# Altium project SSL-Motherboard.PrjPcb
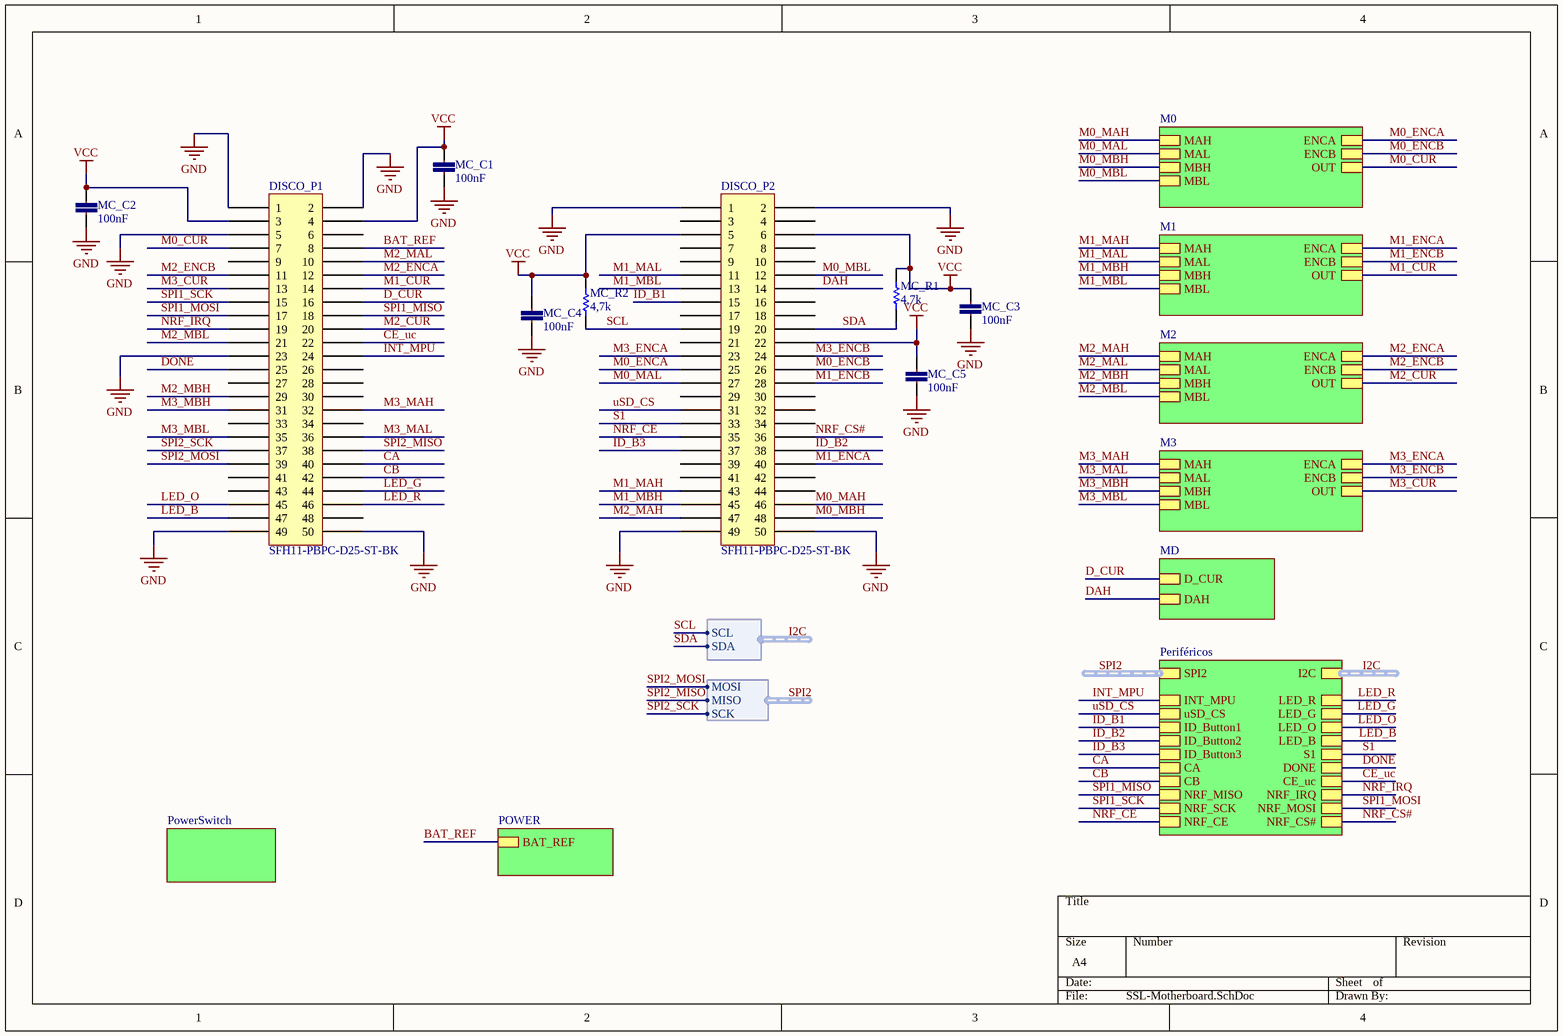
[diagram p0: SSL-Motherboard.SchDoc]
6 sheets, 114 parts. Net scope: hierarchical (ports join the sheet entries above them; power ports are global).
Board file: SSL-Motherboard.PcbDoc
Sheets:
  SSL-Motherboard.SchDoc
    M0 = Motors.SchDoc
    POWER = PowerSupply.SchDoc
    M1 = Motors.SchDoc
    M2 = Motors.SchDoc
    M3 = Motors.SchDoc
    Periféricos = Peripherals.SchDoc
    MD = Dribble.SchDoc
    PowerSwitch = PowerSwitch.SchDoc

## Sheet SSL-Motherboard.SchDoc
size A4

### Parts
DISCO_P1  SFH11-PBPC-D25-ST-BK  [25x02_Conector_Female]
DISCO_P2  SFH11-PBPC-D25-ST-BK  [25x02_Conector_Female]
MC_C1  100nF  [0402-CAP]
MC_C2  100nF  [0402-CAP]
MC_C3  100nF  [0402-CAP]
MC_C4  100nF  [0402-CAP]
MC_C5  100nF  [0402-CAP]
MC_R1  4,7k  [0402]
MC_R2  4,7k  [0402]

### Sub-sheets
M0 = Motors.SchDoc: MBH, MAH, MBL, MAL, ENCA, ENCB, OUT
M1 = Motors.SchDoc: MBH, MAH, MBL, MAL, ENCA, ENCB, OUT
M2 = Motors.SchDoc: MBH, MAH, MBL, MAL, ENCA, ENCB, OUT
M3 = Motors.SchDoc: MBH, MAH, MBL, MAL, ENCA, ENCB, OUT
MD = Dribble.SchDoc: D_CUR, DAH
Periféricos = Peripherals.SchDoc: INT_MPU, uSD_CS, LED_R, LED_G, LED_O, LED_B, ID_Button1, SPI2 (harness SPI), I2C (harness I2C), S1, CA, CB, CE_uc, NRF_MISO, NRF_SCK, NRF_CE, NRF_IRQ, NRF_MOSI, NRF_CS#, ID_Button2, ID_Button3, DONE
POWER = PowerSupply.SchDoc: BAT_REF
PowerSwitch = PowerSwitch.SchDoc: no entries

### Harnesses
I2C: SCL, SDA
SPI: MOSI, MISO, SCK

### Nets
GND: DISCO_P1.1 DISCO_P1.2 DISCO_P1.5 DISCO_P1.23 DISCO_P1.49 DISCO_P1.50 DISCO_P2.1 DISCO_P2.2 DISCO_P2.49 DISCO_P2.50 MC_C1.1 MC_C2.2 MC_C3.1 MC_C4.1 MC_C5.1
VCC: DISCO_P1.3 DISCO_P1.4 DISCO_P2.5 DISCO_P2.6 DISCO_P2.22 MC_C1.2 MC_C2.1 MC_C3.2 MC_C4.2 MC_C5.2 MC_R1.2 MC_R2.2
BAT_REF: DISCO_P1.8 ; sheet POWER/BAT_REF
CA: DISCO_P1.40 ; sheet Periféricos/CA
CB: DISCO_P1.42 ; sheet Periféricos/CB
CE_uc: DISCO_P1.22 ; sheet Periféricos/CE_uc
D_CUR: DISCO_P1.16 ; sheet MD/D_CUR
DAH: DISCO_P2.14 ; sheet MD/DAH
DONE: DISCO_P1.25 ; sheet Periféricos/DONE
ID_B1: DISCO_P2.15 ; sheet Periféricos/ID_Button1
ID_B2: DISCO_P2.38 ; sheet Periféricos/ID_Button2
ID_B3: DISCO_P2.37 ; sheet Periféricos/ID_Button3
INT_MPU: DISCO_P1.24 ; sheet Periféricos/INT_MPU
LED_B: DISCO_P1.47 ; sheet Periféricos/LED_B  [project net Blue_led]
LED_G: DISCO_P1.44 ; sheet Periféricos/LED_G
LED_O: DISCO_P1.45 ; sheet Periféricos/LED_O
LED_R: DISCO_P1.46 ; sheet Periféricos/LED_R
M0_CUR: DISCO_P1.7 ; sheet M0/OUT
M0_ENCA: DISCO_P2.25 ; sheet M0/ENCA
M0_ENCB: DISCO_P2.26 ; sheet M0/ENCB
M0_MAH: DISCO_P2.46 ; sheet M0/MAH
M0_MAL: DISCO_P2.27 ; sheet M0/MAL
M0_MBH: DISCO_P2.48 ; sheet M0/MBH
M0_MBL: DISCO_P2.12 ; sheet M0/MBL
M1_CUR: DISCO_P1.14 ; sheet M1/OUT
M1_ENCA: DISCO_P2.40 ; sheet M1/ENCA
M1_ENCB: DISCO_P2.28 ; sheet M1/ENCB
M1_MAH: DISCO_P2.43 ; sheet M1/MAH
M1_MAL: DISCO_P2.11 ; sheet M1/MAL
M1_MBH: DISCO_P2.45 ; sheet M1/MBH
M1_MBL: DISCO_P2.13 ; sheet M1/MBL
M2_CUR: DISCO_P1.20 ; sheet M2/OUT
M2_ENCA: DISCO_P1.12 ; sheet M2/ENCA
M2_ENCB: DISCO_P1.11 ; sheet M2/ENCB
M2_MAH: DISCO_P2.47 ; sheet M2/MAH
M2_MAL: DISCO_P1.10 ; sheet M2/MAL
M2_MBH: DISCO_P1.29 ; sheet M2/MBH
M2_MBL: DISCO_P1.21 ; sheet M2/MBL
M3_CUR: DISCO_P1.13 ; sheet M3/OUT
M3_ENCA: DISCO_P2.23 ; sheet M3/ENCA
M3_ENCB: DISCO_P2.24 ; sheet M3/ENCB
M3_MAH: DISCO_P1.32 ; sheet M3/MAH
M3_MAL: DISCO_P1.36 ; sheet M3/MAL
M3_MBH: DISCO_P1.31 ; sheet M3/MBH
M3_MBL: DISCO_P1.35 ; sheet M3/MBL
NRF_CE: DISCO_P2.35 ; sheet Periféricos/NRF_CE
NRF_CS#: DISCO_P2.36 ; sheet Periféricos/NRF_CS#
NRF_IRQ: DISCO_P1.19 ; sheet Periféricos/NRF_IRQ
S1: DISCO_P2.33 ; sheet Periféricos/S1
SCL: DISCO_P2.19 MC_R2.1 ; sheet Periféricos/I2C.SCL  [project net I2C.SCL]
SDA: DISCO_P2.20 MC_R1.1 ; sheet Periféricos/I2C.SDA  [project net I2C.SDA]
SPI1_MISO: DISCO_P1.18 ; sheet Periféricos/NRF_MISO
SPI1_MOSI: DISCO_P1.17 ; sheet Periféricos/NRF_MOSI
SPI1_SCK: DISCO_P1.15 ; sheet Periféricos/NRF_SCK
SPI2_MISO: DISCO_P1.38 ; sheet Periféricos/SPI2.MISO  [project net SPI2.MISO]
SPI2_MOSI: DISCO_P1.39 ; sheet Periféricos/SPI2.MOSI  [project net SPI2.MOSI]
SPI2_SCK: DISCO_P1.37 ; sheet Periféricos/SPI2.SCK  [project net SPI2.SCK]
uSD_CS: DISCO_P2.31 ; sheet Periféricos/uSD_CS

Not connected (* = marked no-connect by the designer): DISCO_P1 6 9 26 27 28 30 33 34 41 43 48; DISCO_P2 3 4 7 8 9 10 16 17 18 21 29 30 32 34 39 41 42 44

### Buses and harness runs
harness I2C = sheet Periféricos/I2C
harness SPI2 = sheet Periféricos/SPI2

### Library data of the parts
DISCO_P1 DISCO_P2 = 25x02_Conector_Female: 50 Position Header Connector 0.100" (2.54mm) Through Hole Gold
MC_C1-MC_C5 = CC0402-100nF-A.12: CAP CER 0.1UF 10V 20% X5R 0402; Part No: VJ0402V104ZXQPBC; Cod EMS: 05.281.006.133; Value: 100n
MC_R1 MC_R2 = Res1: Resistor; Published: 8-Jun-2000; LatestRevisionDate: 17-Jul-2002; LatestRevisionNote: Re-released for DXP Platform.; PackageReference: AXIAL-0.3; Publisher: Altium Limited; PackageDescription: Axial Device, Thru-Hole; 2 Leads; 0.3 in Pin Spacing; Value: 4,7K

## Sheet Motors.SchDoc
size A4
Used 4 times, as channels M0, M1, M2, M3. Parts and nets are listed once, with the designators drawn on the sheet.
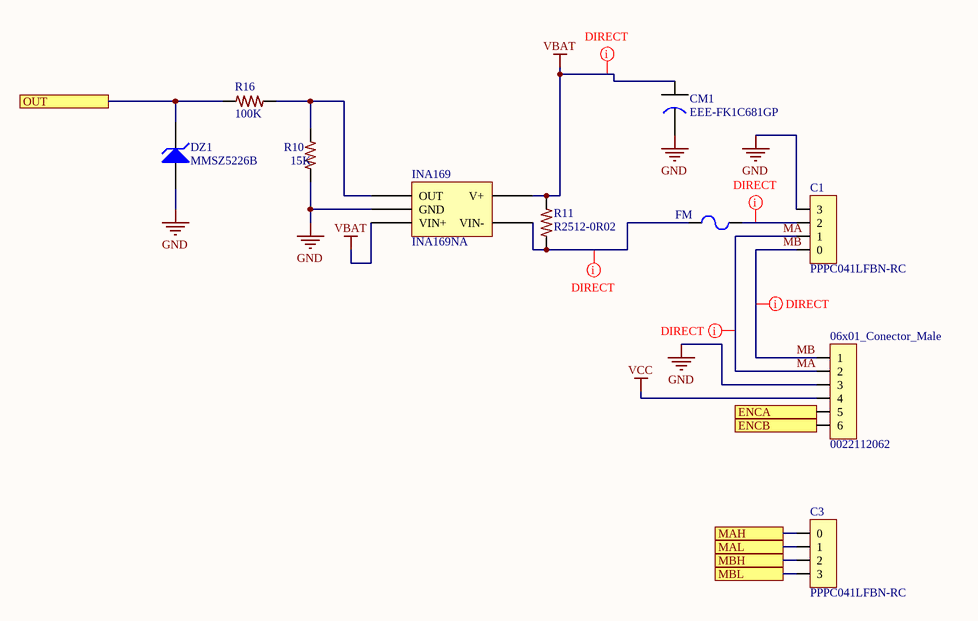
[diagram p1: Motors.SchDoc]

### Parts
06x01_Conector_Male  0022112062  [06x01_Conector_Male]
C1  PPPC041LFBN-RC  [04x01_Conector_Female]
C3  PPPC041LFBN-RC  [04x01_Conector_Female]
CM1  EEE-FK1C681GP  [EEE-FK1C681GP]
DZ1  MMSZ5226B  [FAIR-SOD-123-2_V]
FM  MF-MSMF250/16X  [RESC4632X16N]  (value not drawn)
INA169  INA169NA  [SOT95P280X125-5N]
R10  15K  [0402-RES-HD]
R11  R2512-0R02  [2512-RES-HD]
R16  100K  [0402-RES-HD]

### Ports
ENCA, ENCB, MAH, MAL, MBH, MBL, OUT

### Nets
GND: 06x01_Conector_Male.3 C1.3 CM1.2 DZ1.1(A) INA169.2(GND) R10.1
VBAT: CM1.1 INA169.3(VIN+) INA169.4(V+) R11.2
VCC: 06x01_Conector_Male.4
ENCA: 06x01_Conector_Male.5 ; port ENCA
ENCB: 06x01_Conector_Male.6 ; port ENCB
MA: 06x01_Conector_Male.2 C1.1
MAH: C3.0 ; port MAH
MAL: C3.1 ; port MAL
MB: 06x01_Conector_Male.1 C1.0
MBH: C3.2 ; port MBH
MBL: C3.3 ; port MBL
OUT: DZ1.2(K) R16.2 ; port OUT
NetC1_2: C1.2 FM.1
NetFM_2: FM.2 INA169.5(VIN-) R11.1
NetINA169_1: INA169.1(OUT) R10.2 R16.1

### Channels
M0: designators end in _M0; ports ENCA=M0_ENCA ENCB=M0_ENCB MAH=M0_MAH MAL=M0_MAL MBH=M0_MBH MBL=M0_MBL OUT=M0_CUR
M1: designators end in _M1; ports ENCA=M1_ENCA ENCB=M1_ENCB MAH=M1_MAH MAL=M1_MAL MBH=M1_MBH MBL=M1_MBL OUT=M1_CUR
M2: designators end in _M2; ports ENCA=M2_ENCA ENCB=M2_ENCB MAH=M2_MAH MAL=M2_MAL MBH=M2_MBH MBL=M2_MBL OUT=M2_CUR
M3: designators end in _M3; ports ENCA=M3_ENCA ENCB=M3_ENCB MAH=M3_MAH MAL=M3_MAL MBH=M3_MBH MBL=M3_MBL OUT=M3_CUR

### Layout directives
net class DIRECT: MA_M0, MB_M0, NetC1_M0_2, NetFM_M0_2, VBAT

### Library data of the parts
06x01_Conector_Male = 06x01_Conector_Male: CONN HEADER 6POS .100 VERT GOLD
C1 C3 = 04x01_Conector_Female-SCH: 4 Position Header Connector 0.100" (2.54mm) Through Hole Gold
CM1 = CAP AL 680UF/16V: Aluminum Electrolytic Capacitors - SMD Al Lytic Cap SMT FK Series 105C
DZ1 = CMP-2000-06741-1: Zener Diode, 3.3 V, -55 to 150 degC, 2-Pin SOD-123，RoHS, Tape and Reel; Manufacturer: FairchildSemiconductor; Configuration: Single; Maximum Reverse Leakage Current: 25uA; Zener Voltage Tolerance: 5%; Rad Hard: No; Maximum Power Dissipation: 500mW; Nominal Zener Voltage: 3.3V; Mounting: SurfaceMount; Datasheet Version: Rev. 1.6, 10/2015; Operating Temperature: -55to150°C; Category: Zener; Package: 2SOD-123; Package Reference: SOD-123-2; Datasheet URL: https://www.fairchildsemi.com/datasheets/MM/MMSZ5226B.pdf; Packaging: Tape&Reel; Mounting Technology: SurfaceMount; Package Description: 2-Pin Surface Mount Device, Body 2.7 x 1.6 mm; Manufacturer URL: https://www.fairchildsemi.com/
FM = MF-MSMF250/16X-01.A.1: PTC RESETTABLE .30A 30V 1812
INA169 = INA169NA-01.A.1: IC CURRENT MONITOR 0.5% SOT23-5
R10 R16 = R0402-1K-A.9: RES 1K OHM 1/10W 1% 0402 SMD; Part No: ERJ-2RKF1001X; Cod EMS: 05.280.029.527; Family Description: RESISTOR FILME ESPESSO 10R-1M / 1/10W / 1% / 0402. P/N: ERJ-2RKF....X – PANASONIC ELECTRONIC COMPONENTS.; Value: 1K; Family: ERJ-2RKF....X
R11 = R2512-0R02-4: RES .02 OHM 2W 1% 2512 SMD; Part No: WSL2512R0200FEA18; Cod EMS: 05.280.029.529; Value: 0.02; Family Description: RESISTOR SENTIDO DE CORRENTE 0,010R-0,040R/ 2W / 1% / 2512 P/N: WSL2512.....FEA18 – VISHAY DALE.; Family: WSL2512.....FEA18

## Sheet PowerSupply.SchDoc
size A4
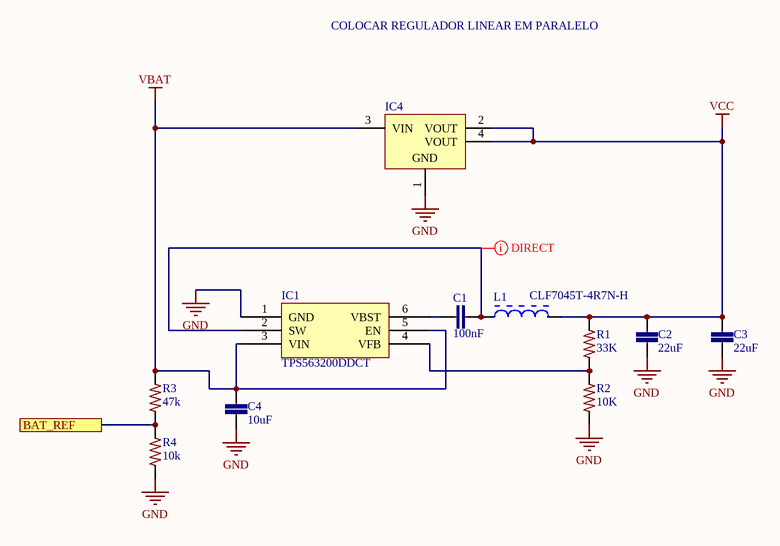
[diagram p2: PowerSupply.SchDoc]

### Parts
C1  100nF  [0402-CAP]
C2  22uF  [1206-CAP]
C3  22uF  [1206-CAP]
C4  10uF  [1210-CAP]
IC1  TPS563200DDCT  [SOT95P280X110-6N]
IC4  LD1117S33CTR  [SOT-223_N]  (value not drawn)
L1  CLF7045T-4R7N-H  [CLF7045T]
R1  33K  [0402-RES-HD]
R2  10K  [0402-RES-HD]
R3  47k  [0402-RES-HD]
R4  10k  [0402-RES-HD]

### Ports
BAT_REF

### Nets
GND: C2.1 C3.1 C4.1 IC1.1(GND) IC4.1(GND) R2.1 R4.1
VBAT: C4.2 IC1.3(VIN) IC1.5(EN) IC4.3(VIN) R3.2
VCC: C2.2 C3.2 IC4.2(VOUT) IC4.4(VOUT) L1.2 R1.2
BAT_REF: R3.1 R4.2 ; port BAT_REF
NetC1_1: C1.1 IC1.6(VBST)
NetC1_2: C1.2 IC1.2(SW) L1.1
NetIC1_4: IC1.4(VFB) R1.1 R2.2

### Layout directives
net class DIRECT: NetC1_2

### Notes on the sheet
- COLOCAR REGULADOR LINEAR EM PARALELO

### Library data of the parts
C1 = CC0402-100nF-50v-A.3: CAP CER 0.1UF 50V 10% X7R 0402; Part No: C1005X7R1H104K050BB; Value: 100n; Cod EMS: 05.281.019.021
C2 C3 = CC1206-22uF-6.3V-1: CAP CER 22UF 6.3V 20% X5R 1206; Part No: C3216X5R0J226M085AC; Value: 22u; Rule: UNIONINDEX{}0[]RULEKIND{}PolygonConnect[]NETSCOPE{}AnyNet[]LAYERKIND{}SameLayer[]NAME{}Schematic Polygon Connect Style[]CONNECTSTYLE{}Direct[]RELIEFCONDUCTORWIDTH{}10mil[]RELIEFENTRIES{}4[]POLYGONRELIEFANGLE{}45 Angle[]AIRGAPWIDTH{}10mil[]UNIT{}Imperial[]PcbType{}ProtelPcb
C4 = CC1210-10uF-6: CAP CER 10UF 50V 20% X5R 1210; Part No: UMK325BJ106MM; value: 10u; Cod EMS: 05.281.019.522
IC1 = TPS563200DDCT-01.A.2: IC REG BUCK ADJ 3A SYNC 6SOT
IC4 = CMP-0244-00307-1: Fixed Low Drop Positive Voltage Regulator, 3.3V, 4-Pin SOT-223, Tape and Reel; ComponentLink1URL: http://www.st.com; PackageVersion: 2010; ComponentLink1Description: Manufacturer URL; DatasheetVersion: 1/11/2011; ComponentLink2URL: http://www.st.com/internet/com/TECHNICAL_RESOURCES/TECHNICAL_LITERATURE/DATASHEET/CD00000544.pdf; PackageReference: SOT-223; ComponentLink2Description: Datasheet; PackageDescription: 4-Pin SOT-223 Package, 6.5 x 3.5 mm Body, 2.3 mm Pitch, 7 mm Lead Span
L1 = CLF7045T-4R7N-H-2: FIXED IND 4.7UH 4.1A 20 MOHM SMD; Family Description: INDUTORES FIXOS 7,2x6,9mm TDK CLF7045T -45 A 125oC; Rule: UNIONINDEX{}0[]RULEKIND{}PolygonConnect[]NETSCOPE{}AnyNet[]LAYERKIND{}SameLayer[]NAME{}Schematic Polygon Connect Style[]CONNECTSTYLE{}Direct[]RELIEFCONDUCTORWIDTH{}10mil[]RELIEFENTRIES{}4[]POLYGONRELIEFANGLE{}45 Angle[]AIRGAPWIDTH{}10mil[]UNIT{}Imperial[]PcbType{}ProtelPcb; Part No: CLF7045T-4R7N-H; Family: CLF7045T
R1 = R0402-33K-7: RES 33K OHM 1/10W 1% 0402 SMD; Part No: ERJ-2RKF3302X; Family Description: RESISTOR FILME ESPESSO 10R-1M / 1/10W / 1% / 0402. P/N: ERJ-2RKF....X – PANASONIC ELECTRONIC COMPONENTS.; Cod EMS: 05.280.029.535; Value: 33K; Family: ERJ-2RKF....X
R2 = R0402-10K-10: RES 10K OHM 1/10W 1% 0402 SMD; Part No: ERJ-2RKF1002X; Cod EMS: 05.280.029.525; Family Description: RESISTOR FILME ESPESSO 10R-1M / 1/10W / 1% / 0402. P/N: ERJ-2RKF....X – PANASONIC ELECTRONIC COMPONENTS.; Value: 10K; Family: ERJ-2RKF....X
R3 = R0402-10K-10: RES 47k OHM 1/10W 1% 0402 SMD; Part No: ERJ-2RKF1002X; Cod EMS: 05.280.029.525; Value: 330; Family Description: RESISTOR FILME ESPESSO 10R-1M / 1/10W / 1% / 0402. P/N: ERJ-2RKF....X – PANASONIC ELECTRONIC COMPONENTS.; Family: ERJ-2RKF....X
R4 = R0402-33K-7: RES 10k OHM 1/10W 1% 0402 SMD; Part No: ERJ-2RKF3302X; Cod EMS: 05.280.029.535; Value: 100; Family Description: RESISTOR FILME ESPESSO 10R-1M / 1/10W / 1% / 0402. P/N: ERJ-2RKF....X – PANASONIC ELECTRONIC COMPONENTS.; Family: ERJ-2RKF....X

## Sheet Peripherals.SchDoc
size A4
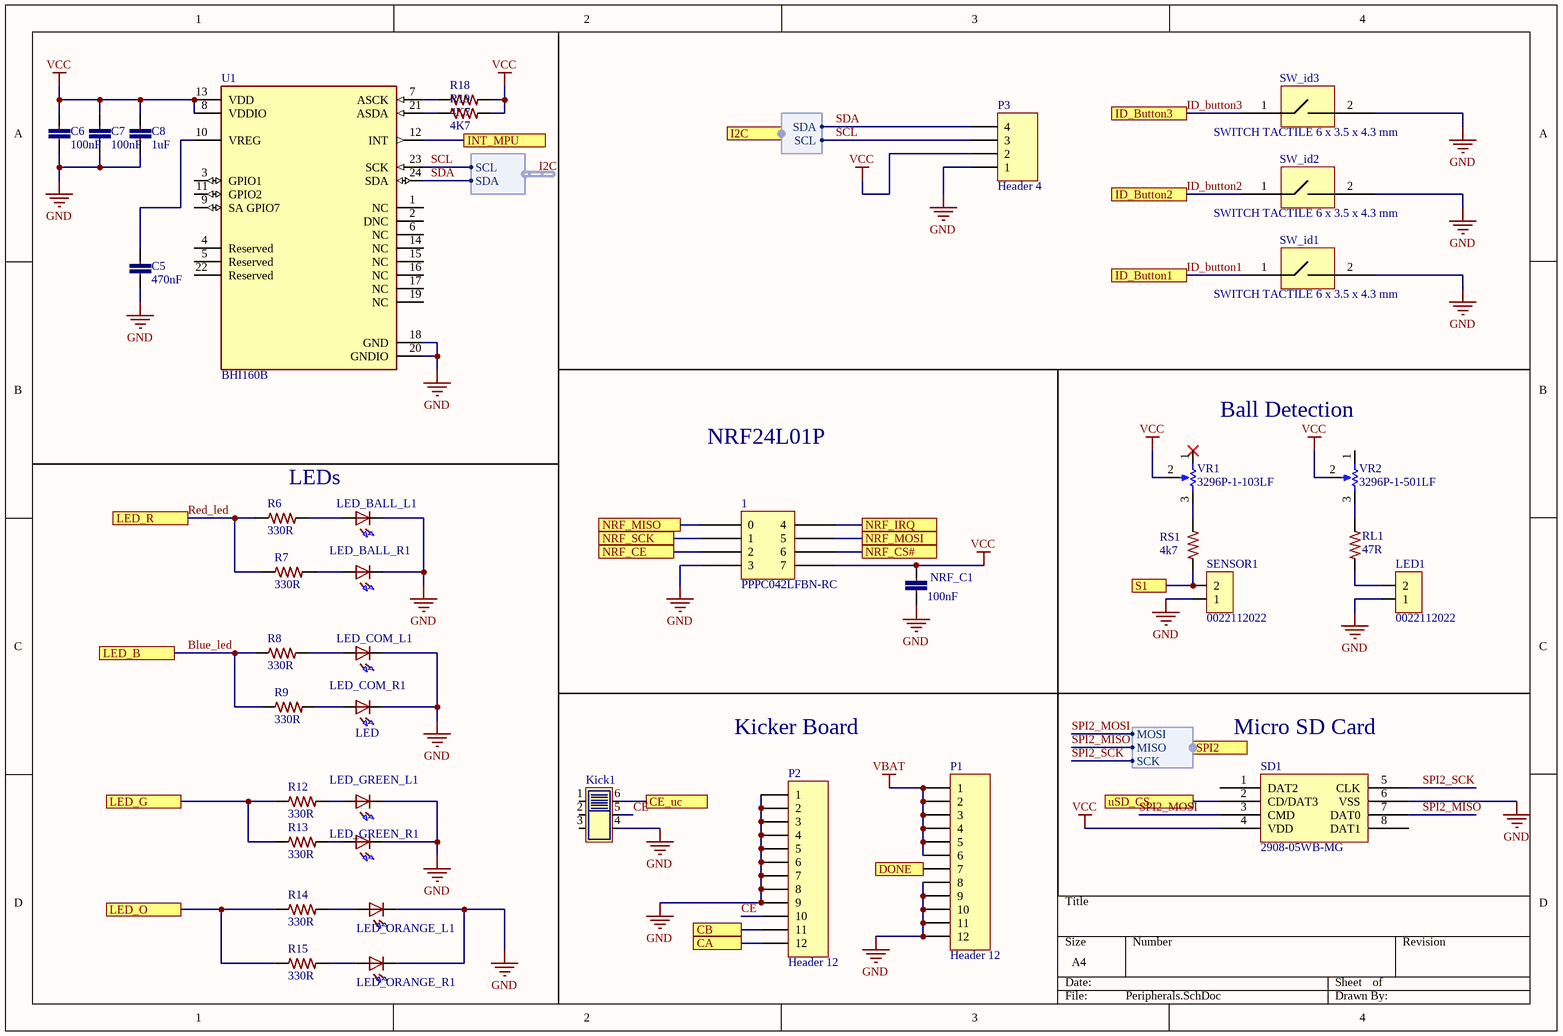
[diagram p3: Peripherals.SchDoc]

### Parts
1  PPPC042LFBN-RC  [04x02_Conector_Female]
C5  470nF  [0402-CAP]
C6  100nF  [0402-CAP]
C7  100nF  [0402-CAP]
C8  1uF  [0402-CAP]
Kick1  JS202011SCQN  [SOP250P750X350-6N]  (value not drawn)
LED1  0022112022  [02x01_Conector_Male]
LED_BALL_L1  LED  [LED-5MM-PCB]  (value not drawn)
LED_BALL_R1  LED  [LED-5MM-PCB]  (value not drawn)
LED_COM_L1  LED  [LED-5MM-PCB]  (value not drawn)
LED_COM_R1  LED  [LED-5MM-PCB]
LED_GREEN_L1  LED  [LED-5MM-PCB]  (value not drawn)
LED_GREEN_R1  LED  [LED-5MM-PCB]  (value not drawn)
LED_ORANGE_L1  LED  [LED-5MM-PCB]  (value not drawn)
LED_ORANGE_R1  LED  [LED-5MM-PCB]  (value not drawn)
NRF_C1  100nF  [0402-CAP]
P1  Header 12  [HDR1X12]
P2  Header 12  [HDR1X12]
P3  Header 4  [HDR1X4]
R6  330R  [0402-RES-HD]
R7  330R  [0402-RES-HD]
R8  330R  [0402-RES-HD]
R9  330R  [0402-RES-HD]
R12  330R  [0402-RES-HD]
R13  330R  [0402-RES-HD]
R14  330R  [0402-RES-HD]
R15  330R  [0402-RES-HD]
R18  4K7  [0805-RES]
R19  4K7  [0805-RES]
RL1  47R  [0402-RES-HD]
RS1  4k7  [0402-RES-HD]
SD1  2908-05WB-MG  [New footprint 1]
SENSOR1  0022112022  [02x01_Conector_Male]
SW_id1  SWITCH TACTILE 6 x 3.5 x 4.3 mm  [PCBComponent]
SW_id2  SWITCH TACTILE 6 x 3.5 x 4.3 mm  [PCBComponent]
SW_id3  SWITCH TACTILE 6 x 3.5 x 4.3 mm  [PCBComponent]
U1  BHI160B  [FP-BHI160B-MFG]
VR1  3296P-1-103LF  [3296P]
VR2  3296P-1-501LF  [3296P]

### Ports
CA, CB, CE_uc, DONE, I2C (harness I2C), ID_Button1, ID_Button2, ID_Button3, INT_MPU, LED_B, LED_G, LED_O, LED_R, NRF_CE, NRF_CS#, NRF_IRQ, NRF_MISO, NRF_MOSI, NRF_SCK, S1, SPI2 (harness SPI), uSD_CS

### Harnesses
I2C: SCL, SDA
SPI: MOSI, MISO, SCK

### Nets
GND: 1.3 C5.2 C6.2 C7.2 C8.2 Kick1.4 LED1.1 LED_BALL_L1.1(K) LED_BALL_R1.1(K) LED_COM_L1.1(K) LED_COM_R1.1(K) LED_GREEN_L1.1(K) LED_GREEN_R1.1(K) LED_ORANGE_L1.1(K) LED_ORANGE_R1.1(K) NRF_C1.2 P1.8 P1.9 P1.10 P1.11 P1.12 P2.1 P2.2 P2.3 P2.4 P2.5 P2.6 P2.7 P2.8 P2.9 P3.1 SD1.6(VSS) SENSOR1.1 SW_id1.2 SW_id2.2 SW_id3.2 U1.18(GND) U1.20(GNDIO)
VBAT: P1.1 P1.2 P1.3 P1.4 P1.5 P1.6
VCC: 1.7 C6.1 C7.1 C8.1 NRF_C1.1 P3.2 R18.2 R19.2 SD1.4(VDD) U1.8(VDDIO) U1.13(VDD) VR1.2(Wiper) VR2.2(Wiper)
Blue_led: R8.1 R9.1 ; port LED_B
CA: P2.12 ; port CA
CB: P2.11 ; port CB
CE: Kick1.5 P2.10
CE_uc: Kick1.6 ; port CE_uc
DONE: P1.7 ; port DONE
ID_button1: SW_id1.1 ; port ID_Button1  [project net ID_B1]
ID_button2: SW_id2.1 ; port ID_Button2  [project net ID_B2]
ID_button3: SW_id3.1 ; port ID_Button3  [project net ID_B3]
INT_MPU: U1.12(INT) ; port INT_MPU
LED_G: R12.1 R13.1 ; port LED_G
LED_O: R14.1 R15.1 ; port LED_O
NRF_CE: 1.2 ; port NRF_CE
NRF_CS#: 1.6 ; port NRF_CS#
NRF_IRQ: 1.4 ; port NRF_IRQ
Red_led: R6.1 R7.1 ; port LED_R  [project net LED_R]
S1: RS1.1 SENSOR1.2 ; port S1
SCL: P3.3 U1.23(SCK) ; port I2C.SCL, harness I2C.SCL  [project net I2C.SCL]
SDA: P3.4 U1.24(SDA) ; port I2C.SDA, harness I2C.SDA  [project net I2C.SDA]
SPI1_MISO: 1.0 ; port NRF_MISO
SPI1_MOSI: 1.5 ; port NRF_MOSI
SPI1_SCK: 1.1 ; port NRF_SCK
SPI2_MISO: SD1.7(DAT0) ; port SPI2.MISO  [project net SPI2.MISO]
SPI2_MOSI: SD1.3(CMD) ; port SPI2.MOSI  [project net SPI2.MOSI]
SPI2_SCK: SD1.5(CLK) ; port SPI2.SCK  [project net SPI2.SCK]
uSD_CS: SD1.2(CD/DAT3) ; port uSD_CS
NetC5_1: C5.1 U1.10(VREG)
NetLED1_2: LED1.2 RL1.2
NetLED_BALL_L1_2: LED_BALL_L1.2(A) R6.2
NetLED_BALL_R1_2: LED_BALL_R1.2(A) R7.2
NetLED_COM_L1_2: LED_COM_L1.2(A) R8.2
NetLED_COM_R1_2: LED_COM_R1.2(A) R9.2
NetLED_GREEN_L1_2: LED_GREEN_L1.2(A) R12.2
NetLED_GREEN_R1_2: LED_GREEN_R1.2(A) R13.2
NetLED_ORANGE_L1_2: LED_ORANGE_L1.2(A) R14.2
NetLED_ORANGE_R1_2: LED_ORANGE_R1.2(A) R15.2
NetR18_1: R18.1 U1.7(ASCK)
NetR19_1: R19.1 U1.21(ASDA)
NetRL1_1: RL1.1 VR2.3(CW)
NetRS1_2: RS1.2 VR1.3(CW)

Not connected (* = marked no-connect by the designer): Kick1 1 2 3; SD1 1(DAT2) 8(DAT1); U1 1(NC) 2(DNC) 3(GPIO1) 4(Reserved) 5(Reserved) 6(NC) 9(SA_GPIO7) 11(GPIO2) 14(NC) 15(NC) 16(NC) 17(NC) 19(NC) 22(Reserved); VR1 1(CCW)*; VR2 1(CCW)

### Notes on the sheet
- NRF24L01P
- Ball Detection
- LEDs
- Kicker Board
- (near SD1) Micro SD Card

### Library data of the parts
1 = 04x02_Conector_Female: 8 Position Header Connector 0.100" (2.54mm) Through Hole Gold
C5 = CMP-00169-1: CAP CER 0402 470nF 25V X5R; Part No: C1005X5R1E474K050; Cod EMS: 05.281.019.543; Value: 470nF; Component Type: Capacitor
C6 C7 NRF_C1 = CC0402-100nF-A.12: as MC_C1 on sheet SSL-Motherboard
C8 = CC0402-1uF-5: CAP CER 1UF 6.3V 10% X5R 0402; Part No: JMK105BJ105KV-F; Cod EMS: 05.281.019.513; Value: 1u
Kick1 = JS202011SCQN-1: SWITCH SLIDE DPDT 300MA 6V; Part No: JS202011SCQN
LED1 SENSOR1 = 02x01_Conector_Male: CONN HEADER 2POS .100 VERT GOLD
LED_BALL_L1 LED_BALL_R1 LED_COM_L1 LED_COM_R1 LED_GREEN_L1 LED_GREEN_R1 LED_ORANGE_L1 LED_ORANGE_R1 = LED-5MM-3: LED 5MM PTH
P1 P2 = Header 12: Header, 12-Pin; LatestRevisionDate: 17-Jul-2002; LatestRevisionNote: Re-released for DXP Platform.; Publisher: Altium Limited
P3 = Header 4: Header, 4-Pin; LatestRevisionDate: 17-Jul-2002; LatestRevisionNote: Re-released for DXP Platform.; Publisher: Altium Limited
R6-R9 R12-R15 = R0402-330R-7: RES 330 OHM 1/10W 1% 0402 SMD; Part No: ERJ-2RKF3300X; Cod EMS: 05.280.029.506; Value: 330; Family Description: RESISTOR FILME ESPESSO 10R-1M / 1/10W / 1% / 0402. P/N: ERJ-2RKF....X – PANASONIC ELECTRONIC COMPONENTS.; Family: ERJ-2RKF....X
R18 R19 = R0805-4K7-1: RES SMD 4.7K OHM 1% 1/8W 0805; Part No: CRCW08054K70FKEA; Cod EMS: 05.280.029.425; Family: CRCW; Value: 4K7
RL1 = R0402-100R-5: RES 47 OHM 1/10W 1% 0402 SMD; Part No: ERJ-2RKF1000X; Value: 100; Cod EMS: 05.280.029.519; Family Description: RESISTOR FILME ESPESSO 10R-1M / 1/10W / 1% / 0402. P/N: ERJ-2RKF....X – PANASONIC ELECTRONIC COMPONENTS.; Family: ERJ-2RKF....X
RS1 = R0402-330R-7: RES 4k7 OHM 1/10W 1% 0402 SMD; Part No: ERJ-2RKF3300X; Value: 330; Cod EMS: 05.280.029.506; Family Description: RESISTOR FILME ESPESSO 10R-1M / 1/10W / 1% / 0402. P/N: ERJ-2RKF....X – PANASONIC ELECTRONIC COMPONENTS.; Family: ERJ-2RKF....X
SD1 = 2908-05WB-MG-01.A.1: CONN MICRO SD CARD PUSH-PUSH R/A
SW_id1-SW_id3 = 95C04A3GWRT.-1: GRAYHILL TACT,GW,6X3.5,1800T&R,LF Eight, 160g Operating Force, Gull Wing, RoHS Compliant; Part No: 95C04A3GWRT
U1 = CMP-191067-000004-1: IMU ACCEL/GYRO 3-AXIS I2C 24LGA; Manufacturer: Bosch Sensortec; Accel Resolution: 16bits; Operating Supply Current: 300-800uA; Sensor Type: Temperature,Accelerometer,Gyroscope; Accel Range: 2/4/8/16g; Gyro Sensitivity: 16.4/32.8/65.6/131.2/262.4LSB/°/s; Min Supply Voltage: 1.6V; Gyro Range: 125/250/500/1000/2000°/s; Accel Sensitivity: 2048/4096/8192/16384LSB/g; Max Supply Voltage: 3.6V; Sensor Output: I2C; Lead Free: Yes; Temperature: -40°C to +85°C; Height: 1mm; Ambient Temperature Range High: +85°C; Manufacturer Part Number: BHI160B; Temperature Range Low: -40°C; Category: IC; Octopart: https://octopart.com/bhi160b-bosch+sensortec-108216126; ComponentLink2URL: https://ae-bst.resource.bosch.com/media/_tech/media/datasheets/BST-BHI160B-DS000.pdf; RoHS: TRUE; Ambient Temperature Range Low: -40°C; Digikey Description: IMU ACCEL/GYRO 3-AXIS I2C 24LGA; Device Class L1: Sensors; Temperature Range High: +85°C; ComponentLink2Description: Datasheet; Package: 0; Device Class L2: Motion Sensors; Device Class L3: Inertial Measurement Units (IMUs); Automotive: No; Resolution: 16bits
VR1 = 3296P-1-103LF: Trimmer;  Cermet;  Rest 10 Kilohms;  PCB;  25 Turns;  Pwr-Rtg 0.5W; Manufacturer: Bourns; Manufacturer Series: 3296; Number of Terminals/Pins: 3; Max Power Dissipation: 500mW; Tolerance: 10%; Resistance: 10kR; Number of Turns: 25; Temperature Coefficient: 100ppm/°C; Resistance Law: Linear; Actuator Orientation: Horizontal; Actuator Type: SCREW; Supplier 1: Digi-Key; Manufacturer Part Number: 3296P-1-103LF; RoHS: Yes; Category: Variable Resistors and Potentiometers; Stock 1: 416; Pricing 1: 1=2.41000, 10=2.11700, 25=1.89800, 50=1.82500, 100=1.75200, 250=1.67900, 500=1.38700, 1000=1.31400, 5000=1.09500 (USD); Mount: Through Hole,Panel,PCB; Number of Pins: 3; Weight: 0.03oz; Color: Blue; Terminal Finish: Tin; Min Operating Temperature: -55°C; Max Operating Temperature: 125°C; Package Quantity: 50; Packaging: Rail/Tube; Series: 3296; Power Rating: 500mW; Termination: Pin; Taper: Linear; Resistor Type: Cermet; Technology: CERMET; Resistance Tolerance: 10%; Type: Potentiometer; Length: 9.53mm; Width: 9.53mm; Height: 0.19inch; Depth: 11.55mm; Radiation Hardening: No; Lead Free: Lead Free; RoHS Compliant: Yes; Military Standard: Not; REACH SVHC: No SVHC; ComponentLink1URL: https://datasheet.ciiva.com/19459/1156752-19459714.pdf?src-supplier=Jameco; ComponentLink1Description: https://datasheet.ciiva.com/19459/1156752-19459714.pdf?src-supplier=Jameco; ComponentLink2URL: https://datasheet.ciiva.com/11830/0900766b8069ccf4-11830968.pdf?src-supplier=RSComponents; ComponentLink2Description: https://datasheet.ciiva.com/11830/0900766b8069ccf4-11830968.pdf?src-supplier=RSComponents; ComponentLink3URL: https://datasheet.ciiva.com/29122/447267-da-01-en-trimmer-tht3296p-1-103lf-10k-0-5w-29122348.pdf?src-supplier=Conrad; ComponentLink3Description: https://datasheet.ciiva.com/29122/447267-da-01-en-trimmer-tht3296p-1-103lf-10k-0-5w-29122348.pdf?src-supplier=Conrad; ComponentLink4URL: https://datasheet.ciiva.com/2158/3296-2158320.pdf?src-supplier=Digi-Key; ComponentLink4Description: https://datasheet.ciiva.com/2158/3296-2158320.pdf?src-supplier=Digi-Key; ComponentLink5URL: https://datasheet.ciiva.com/14173/ew3296-dat-e-14173048.pdf?src-supplier=Distrelec; ComponentLink5Description: https://datasheet.ciiva.com/14173/ew3296-dat-e-14173048.pdf?src-supplier=Distrelec; ComponentLink6URL: https://datasheet.ciiva.com/3266/3296-3266181.pdf?src-supplier=Avnet; ComponentLink6Description: https://datasheet.ciiva.com/3266/3296-3266181.pdf?src-supplier=Avnet; ComponentLink7URL: https://datasheet.ciiva.com/1131/1815117-1131225.pdf?src-supplier=Element14; ComponentLink7Description: https://datasheet.ciiva.com/1131/1815117-1131225.pdf?src-supplier=Element14; ComponentLink8URL: https://datasheet.ciiva.com/16714/70153578-16714831.pdf?src-supplier=Allied+Electronics; ComponentLink8Description: https://datasheet.ciiva.com/16714/70153578-16714831.pdf?src-supplier=Allied+Electronics
VR2 = 3296P-1-501LF: Res Cermet Trimmer 500 Ohm 10% 1/2W 25(Elec)Turn 2.19mm (9.53 X 11.55 X 4.83mm) Pin Thru-Hole Tube; Manufacturer: Bourns; Max Power Dissipation: 500mW; Resistance: 500R; Number of Turns: 25; Temperature Coefficient: 100ppm/°C; Supplier 1: Digi-Key; Manufacturer Part Number: 3296P-1-501LF; RoHS: Yes; Category: Variable Resistors and Potentiometers; Stock 1: 1167; Pricing 1: 1=2.58000, 10=2.26400, 25=2.03000, 50=1.95200, 100=1.87400, 250=1.79588, 500=1.48356, 1000=1.40548, 5000=1.17123 (USD); Mount: Panel,Through Hole,PCB; Weight: 0.03oz; Color: Blue; Min Operating Temperature: -55°C; Max Operating Temperature: 125°C; Package Quantity: 50; Packaging: Rail/Tube; Series: 3296; Tolerance: 10%; Power Rating: 500mW; Termination: Pin; Taper: Linear; Resistor Type: Cermet; Technology: CERMET; Resistance Tolerance: 10%; Length: 9.53mm; Width: 9.53mm; Height: 0.19inch; Depth: 11.55mm; Radiation Hardening: No; Lead Free: Lead Free; Military Standard: Not; REACH SVHC: No SVHC; ComponentLink1URL: https://datasheet.ciiva.com/11832/0900766b8069ccf4-11832224.pdf?src-supplier=RSComponents; ComponentLink1Description: https://datasheet.ciiva.com/11832/0900766b8069ccf4-11832224.pdf?src-supplier=RSComponents; ComponentLink2URL: https://datasheet.ciiva.com/1131/684085-1131232.pdf?src-supplier=Element14; ComponentLink2Description: https://datasheet.ciiva.com/1131/684085-1131232.pdf?src-supplier=Element14; ComponentLink3URL: https://datasheet.ciiva.com/29122/447272-da-01-en-trimmer-tht3296p-1-501lf-500-r-0-5w-29122358.pdf?src-supplier=Conrad; ComponentLink3Description: https://datasheet.ciiva.com/29122/447272-da-01-en-trimmer-tht3296p-1-501lf-500-r-0-5w-29122358.pdf?src-supplier=Conrad; ComponentLink4URL: https://datasheet.ciiva.com/2158/3296-2158318.pdf?src-supplier=Digi-Key; ComponentLink4Description: https://datasheet.ciiva.com/2158/3296-2158318.pdf?src-supplier=Digi-Key; ComponentLink5URL: https://datasheet.ciiva.com/3266/3296-3266511.pdf?src-supplier=Avnet; ComponentLink5Description: https://datasheet.ciiva.com/3266/3296-3266511.pdf?src-supplier=Avnet; ComponentLink6URL: https://datasheet.ciiva.com/16715/70153578-16715738.pdf?src-supplier=Allied+Electronics; ComponentLink6Description: https://datasheet.ciiva.com/16715/70153578-16715738.pdf?src-supplier=Allied+Electronics; ComponentLink7URL: https://datasheet.ciiva.com/30076/3296-30076157.pdf?src-supplier=Onlinecomponents.com; ComponentLink7Description: https://datasheet.ciiva.com/30076/3296-30076157.pdf?src-supplier=Onlinecomponents.com; ComponentLink8URL: https://datasheet.ciiva.com/15156/getdatasheetpartid-171371-15156762.pdf?src-supplier=Verical; ComponentLink8Description: https://datasheet.ciiva.com/15156/getdatasheetpartid-171371-15156762.pdf?src-supplier=Verical; ComponentLink9URL: https://datasheet.ciiva.com/16807/3296-16807529.pdf?src-supplier=Avnet+Europe; ComponentLink9Description: https://datasheet.ciiva.com/16807/3296-16807529.pdf?src-supplier=Avnet+Europe

## Sheet Dribble.SchDoc
size A4
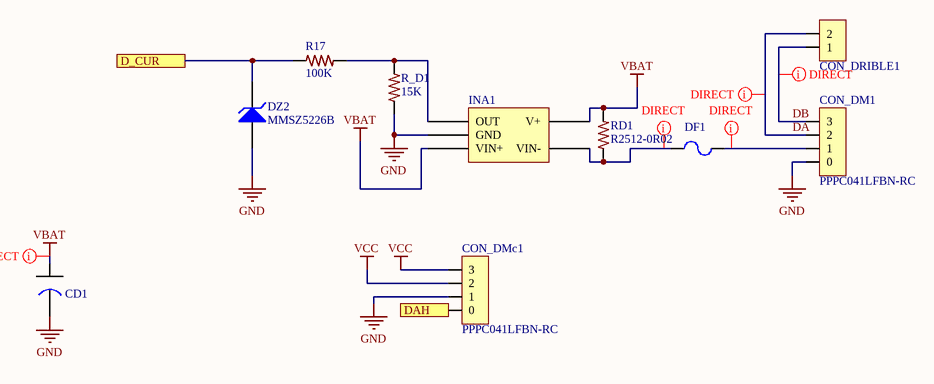
[diagram p4: Dribble.SchDoc]

### Parts
CD1  EEE-FK1C681GP  [EEE-FK1C681GP]  (value not drawn)
CON_DM1  PPPC041LFBN-RC  [04x01_Conector_Female - duplicate]
CON_DMc1  PPPC041LFBN-RC  [04x01_Conector_Female - duplicate]
CON_DRIBLE1  0022112022  [02x01_Conector_Male]  (value not drawn)
DF1  MF-MSMF250/16X  [RESC4632X16N]  (value not drawn)
DZ2  MMSZ5226B  [FAIR-SOD-123-2_V]
INA1  INA169NA  [SOT95P280X125-5N]  (value not drawn)
R17  100K  [0402-RES-HD]
R_D1  15K  [0402-RES-HD]
RD1  R2512-0R02  [2512-RES-HD]

### Ports
D_CUR, DAH

### Nets
GND: CD1.2 CON_DM1.0 CON_DMc1.1 DZ2.1(A) INA1.2(GND) R_D1.1
VBAT: CD1.1 INA1.3(VIN+) INA1.4(V+) RD1.2
VCC: CON_DMc1.2 CON_DMc1.3
D_CUR: DZ2.2(K) R17.2 ; port D_CUR
DA: CON_DM1.2 CON_DRIBLE1.2
DAH: CON_DMc1.0 ; port DAH
DB: CON_DM1.3 CON_DRIBLE1.1
NetCON_DM1_1: CON_DM1.1 DF1.1
NetDF1_2: DF1.2 INA1.5(VIN-) RD1.1
NetINA1_1: INA1.1(OUT) R17.1 R_D1.2

### Layout directives
net class DIRECT: DA, DB, NetCON_DM1_1, NetDF1_2, VBAT

### Library data of the parts
CD1 = CAP AL 680UF/16V: as CM1 on sheet Motors
CON_DM1 CON_DMc1 = 04x01_Conector_Female-SCH: as C1 on sheet Motors
CON_DRIBLE1 = 02x01_Conector_Male: CONN HEADER 2POS .100 VERT GOLD
DF1 = MF-MSMF250/16X-01.A.1: PTC RESETTABLE .30A 30V 1812
DZ2 = CMP-2000-06741-1: as DZ1 on sheet Motors; Mounting: SurfaceMount; Datasheet Version: Rev. 1.6, 10/2015; Operating Temperature: -55to150°C; Category: Zener; Package: 2SOD-123; Package Reference: SOD-123-2; Datasheet URL: https://www.fairchildsemi.com/datasheets/MM/MMSZ5226B.pdf; Packaging: Tape&Reel; Mounting Technology: SurfaceMount; Package Description: 2-Pin Surface Mount Device, Body 2.7 x 1.6 mm; Manufacturer URL: https://www.fairchildsemi.com/
INA1 = INA169NA-01.A.1: IC CURRENT MONITOR 0.5% SOT23-5
R17 R_D1 = R0402-1K-A.9: as R10 on sheet Motors; Value: 1K; Family: ERJ-2RKF....X
RD1 = R2512-0R02-4: as R11 on sheet Motors; Family: WSL2512.....FEA18

## Sheet PowerSwitch.SchDoc
size A
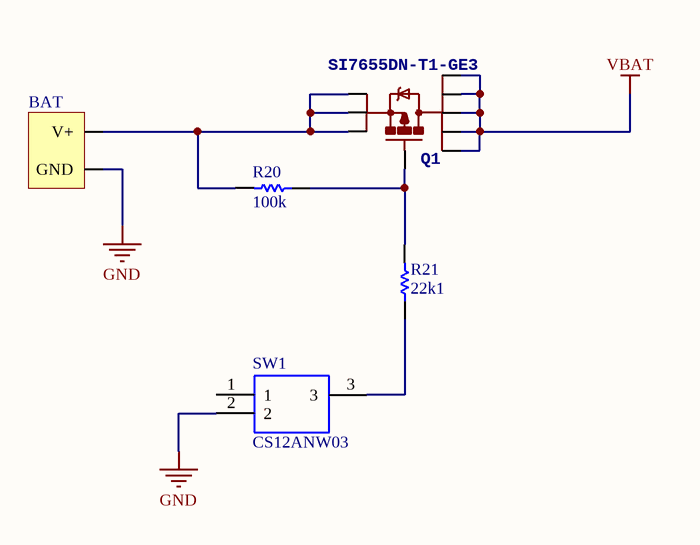
[diagram p5: PowerSwitch.SchDoc]

### Parts
BAT  XT60  [BATTERY_CONECTO-PCB]  (value not drawn)
Q1  SI7655DN-T1-GE3  [SON8]
R20  100k  [0402]
R21  22k1  [0402]
SW1  CS12ANW03  [CS12ANW03]

### Nets
GND: BAT.1(GND) SW1.2
VBAT: Q1.5(D) Q1.6(D) Q1.7(D) Q1.8(D) Q1.9(D)
NetBAT_0: BAT.0(V+) Q1.1(S) Q1.2(S) Q1.3(S) R20.2
NetQ1_4: Q1.4(G) R20.1 R21.2
NetR21_1: R21.1 SW1.3

Not connected (* = marked no-connect by the designer): SW1 1

### Library data of the parts
BAT = BATTERY_CONNECTOR: XT60 PRT-10474
Q1 = SI7655DN-T1-GE3-3: MOSFET P-CH 20V D-S PPAK 1212; Cod EMS: 05.284.001.520; Part No: SI7655DN-T1-GE3
R20 R21 = Res1: Resistor; Value: 4,7K; Published: 8-Jun-2000; LatestRevisionDate: 17-Jul-2002; LatestRevisionNote: Re-released for DXP Platform.; PackageReference: AXIAL-0.3; Publisher: Altium Limited; PackageDescription: Axial Device, Thru-Hole; 2 Leads; 0.3 in Pin Spacing
SW1 = CS12ANW03: NKK SWITCHES - CS12ANW03 - SWITCH, SLIDE, SPDT, 3A, 250V, TH; Allied_Number: 70228233; Manufacturer_Name: NKK Switches; Manufacturer_Part_Number: CS12ANW03; RS Part Number: 1251847; RS Price/Stock: http://uk.rs-online.com/web/p/products/1251847; Allied Price/Stock: https://www.alliedelec.com/nkk-switches-cs12anw03/70228233/; Arrow Part Number: CS12ANW03; Arrow Price/Stock: https://www.arrow.com/en/products/cs12anw03/nkk-switches; Datasheet Link: http://www.nkkswitches.com/pdf/cs.pdf

## Nets that join several sheets
GND: SSL-Motherboard (15 pins), M0 (6 pins), PowerSupply (7 pins), M1 (6 pins), M2 (6 pins), M3 (6 pins), Peripherals (38 pins), Dribble (6 pins), PowerSwitch (BAT.1 SW1.2)
VBAT: M0 (CM1_M0.1 INA169_M0.3 INA169_M0.4 R11_M0.2), PowerSupply (5 pins), M1 (CM1_M1.1 INA169_M1.3 INA169_M1.4 R11_M1.2), M2 (CM1_M2.1 INA169_M2.3 INA169_M2.4 R11_M2.2), M3 (CM1_M3.1 INA169_M3.3 INA169_M3.4 R11_M3.2), Peripherals (6 pins), Dribble (CD1.1 INA1.3 INA1.4 RD1.2), PowerSwitch (5 pins)
VCC: SSL-Motherboard (12 pins), M0 (06x01_Conector_Male_M0.4), PowerSupply (6 pins), M1 (06x01_Conector_Male_M1.4), M2 (06x01_Conector_Male_M2.4), M3 (06x01_Conector_Male_M3.4), Peripherals (13 pins), Dribble (CON_DMc1.2 CON_DMc1.3)
BAT_REF: SSL-Motherboard (DISCO_P1.8), PowerSupply (R3.1 R4.2)
Blue_led: SSL-Motherboard (DISCO_P1.47), Peripherals (R8.1 R9.1)
CA: SSL-Motherboard (DISCO_P1.40), Peripherals (P2.12)
CB: SSL-Motherboard (DISCO_P1.42), Peripherals (P2.11)
CE_uc: SSL-Motherboard (DISCO_P1.22), Peripherals (Kick1.6)
D_CUR: SSL-Motherboard (DISCO_P1.16), Dribble (DZ2.2 R17.2)
DAH: SSL-Motherboard (DISCO_P2.14), Dribble (CON_DMc1.0)
DONE: SSL-Motherboard (DISCO_P1.25), Peripherals (P1.7)
I2C.SCL: SSL-Motherboard (DISCO_P2.19 MC_R2.1), Peripherals (P3.3 U1.23)
I2C.SDA: SSL-Motherboard (DISCO_P2.20 MC_R1.1), Peripherals (P3.4 U1.24)
ID_B1: SSL-Motherboard (DISCO_P2.15), Peripherals (SW_id1.1)
ID_B2: SSL-Motherboard (DISCO_P2.38), Peripherals (SW_id2.1)
ID_B3: SSL-Motherboard (DISCO_P2.37), Peripherals (SW_id3.1)
INT_MPU: SSL-Motherboard (DISCO_P1.24), Peripherals (U1.12)
LED_G: SSL-Motherboard (DISCO_P1.44), Peripherals (R12.1 R13.1)
LED_O: SSL-Motherboard (DISCO_P1.45), Peripherals (R14.1 R15.1)
LED_R: SSL-Motherboard (DISCO_P1.46), Peripherals (R6.1 R7.1)
M0_CUR: SSL-Motherboard (DISCO_P1.7), M0 (DZ1_M0.2 R16_M0.2)
M0_ENCA: SSL-Motherboard (DISCO_P2.25), M0 (06x01_Conector_Male_M0.5)
M0_ENCB: SSL-Motherboard (DISCO_P2.26), M0 (06x01_Conector_Male_M0.6)
M0_MAH: SSL-Motherboard (DISCO_P2.46), M0 (C3_M0.0)
M0_MAL: SSL-Motherboard (DISCO_P2.27), M0 (C3_M0.1)
M0_MBH: SSL-Motherboard (DISCO_P2.48), M0 (C3_M0.2)
M0_MBL: SSL-Motherboard (DISCO_P2.12), M0 (C3_M0.3)
M1_CUR: SSL-Motherboard (DISCO_P1.14), M1 (DZ1_M1.2 R16_M1.2)
M1_ENCA: SSL-Motherboard (DISCO_P2.40), M1 (06x01_Conector_Male_M1.5)
M1_ENCB: SSL-Motherboard (DISCO_P2.28), M1 (06x01_Conector_Male_M1.6)
M1_MAH: SSL-Motherboard (DISCO_P2.43), M1 (C3_M1.0)
M1_MAL: SSL-Motherboard (DISCO_P2.11), M1 (C3_M1.1)
M1_MBH: SSL-Motherboard (DISCO_P2.45), M1 (C3_M1.2)
M1_MBL: SSL-Motherboard (DISCO_P2.13), M1 (C3_M1.3)
M2_CUR: SSL-Motherboard (DISCO_P1.20), M2 (DZ1_M2.2 R16_M2.2)
M2_ENCA: SSL-Motherboard (DISCO_P1.12), M2 (06x01_Conector_Male_M2.5)
M2_ENCB: SSL-Motherboard (DISCO_P1.11), M2 (06x01_Conector_Male_M2.6)
M2_MAH: SSL-Motherboard (DISCO_P2.47), M2 (C3_M2.0)
M2_MAL: SSL-Motherboard (DISCO_P1.10), M2 (C3_M2.1)
M2_MBH: SSL-Motherboard (DISCO_P1.29), M2 (C3_M2.2)
M2_MBL: SSL-Motherboard (DISCO_P1.21), M2 (C3_M2.3)
M3_CUR: SSL-Motherboard (DISCO_P1.13), M3 (DZ1_M3.2 R16_M3.2)
M3_ENCA: SSL-Motherboard (DISCO_P2.23), M3 (06x01_Conector_Male_M3.5)
M3_ENCB: SSL-Motherboard (DISCO_P2.24), M3 (06x01_Conector_Male_M3.6)
M3_MAH: SSL-Motherboard (DISCO_P1.32), M3 (C3_M3.0)
M3_MAL: SSL-Motherboard (DISCO_P1.36), M3 (C3_M3.1)
M3_MBH: SSL-Motherboard (DISCO_P1.31), M3 (C3_M3.2)
M3_MBL: SSL-Motherboard (DISCO_P1.35), M3 (C3_M3.3)
NRF_CE: SSL-Motherboard (DISCO_P2.35), Peripherals (1.2)
NRF_CS#: SSL-Motherboard (DISCO_P2.36), Peripherals (1.6)
NRF_IRQ: SSL-Motherboard (DISCO_P1.19), Peripherals (1.4)
S1: SSL-Motherboard (DISCO_P2.33), Peripherals (RS1.1 SENSOR1.2)
SPI1_MISO: SSL-Motherboard (DISCO_P1.18), Peripherals (1.0)
SPI1_MOSI: SSL-Motherboard (DISCO_P1.17), Peripherals (1.5)
SPI1_SCK: SSL-Motherboard (DISCO_P1.15), Peripherals (1.1)
SPI2.MISO: SSL-Motherboard (DISCO_P1.38), Peripherals (SD1.7)
SPI2.MOSI: SSL-Motherboard (DISCO_P1.39), Peripherals (SD1.3)
SPI2.SCK: SSL-Motherboard (DISCO_P1.37), Peripherals (SD1.5)
uSD_CS: SSL-Motherboard (DISCO_P2.31), Peripherals (SD1.2)